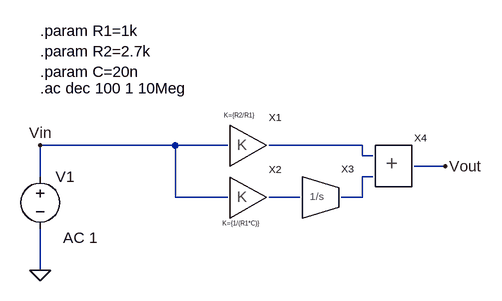
[diagram p0: schematic pid.asc]
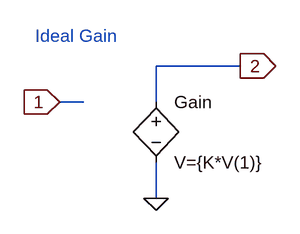
[diagram p1: sub-circuit gain.asc]
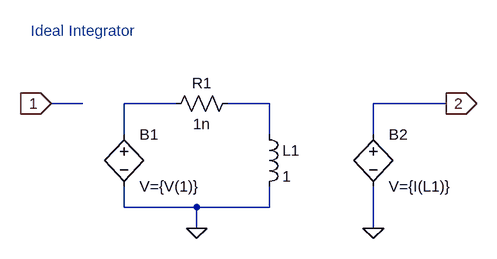
[diagram p2: sub-circuit integrator.asc]
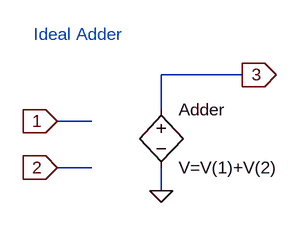
[diagram p3: sub-circuit adder.asc]
pid.asc, the LTspice schematic file:
Version 4
SHEET 1 880 680
WIRE 16 144 -192 144
WIRE 96 144 16 144
WIRE 304 144 160 144
WIRE 304 160 304 144
WIRE 320 160 304 160
WIRE 432 176 384 176
WIRE -192 192 -192 144
WIRE 320 192 304 192
WIRE 16 224 16 144
WIRE 96 224 16 224
WIRE 208 224 160 224
WIRE 304 224 304 192
WIRE 304 224 272 224
WIRE -192 336 -192 272
FLAG 432 176 Vout
FLAG -192 336 0
FLAG -192 144 Vin
SYMBOL gain 128 144 R0
WINDOW 39 -37 -46 Left 0
SYMATTR SpiceLine K={R2/R1}
SYMATTR InstName X1
SYMBOL gain 128 224 R0
WINDOW 39 -39 40 Left 0
SYMATTR SpiceLine K={1/(R1*C)}
SYMATTR InstName X2
SYMBOL integrator 240 224 R0
SYMATTR InstName X3
SYMBOL adder 352 176 R0
SYMATTR InstName X4
SYMBOL voltage -192 176 R0
WINDOW 123 35 110 Left 2
WINDOW 39 0 0 Left 0
WINDOW 3 35 82 Left 2
SYMATTR Value2 AC 1
SYMATTR Value ""
SYMATTR InstName V1
TEXT -192 -32 Left 2 !.param R1=1k\n.param R2=2.7k\n.param C=20n
TEXT -192 56 Left 2 !.ac dec 100 1 10Meg

gain.asc, the sub-circuit schematic file:
Version 4
SHEET 1 880 680
WIRE 224 64 112 64
WIRE 16 112 -16 112
WIRE 112 112 112 64
WIRE 112 240 112 192
FLAG -16 112 1
IOPIN -16 112 In
FLAG 224 64 2
IOPIN 224 64 Out
FLAG 112 240 0
SYMBOL bv 112 96 R0
SYMATTR InstName Gain
SYMATTR Value V={K*V(1)}
TEXT -48 24 Left 2 ;Ideal Gain

integrator.asc, the sub-circuit schematic file:
Version 4
SHEET 1 880 680
WIRE 32 96 -16 96
WIRE 176 96 96 96
WIRE 320 96 256 96
WIRE 592 96 480 96
WIRE 96 144 96 96
WIRE 320 144 320 96
WIRE 480 144 480 96
WIRE 96 256 96 224
WIRE 208 256 96 256
WIRE 320 256 320 224
WIRE 320 256 208 256
WIRE 208 288 208 256
WIRE 480 288 480 224
FLAG -16 96 1
IOPIN -16 96 In
FLAG 208 288 0
FLAG 480 288 0
FLAG 592 96 2
IOPIN 592 96 Out
SYMBOL bv 96 128 R0
SYMATTR InstName B1
SYMATTR Value V={V(1)}
SYMBOL bv 480 128 R0
SYMATTR InstName B2
SYMATTR Value V={I(L1)}
SYMBOL res 272 80 R90
WINDOW 0 0 56 VBottom 2
WINDOW 3 32 56 VTop 2
SYMATTR InstName R1
SYMATTR Value 1n
SYMBOL ind 304 128 R0
SYMATTR InstName L1
SYMATTR Value 1
TEXT -48 -16 Left 2 ;Ideal Integrator

adder.asc, the sub-circuit schematic file:
Version 4
SHEET 1 880 680
WIRE 288 32 176 32
WIRE 176 80 176 32
WIRE 80 96 32 96
WIRE 80 160 32 160
WIRE 176 192 176 160
FLAG 32 96 1
IOPIN 32 96 In
FLAG 32 160 2
IOPIN 32 160 In
FLAG 288 32 3
IOPIN 288 32 Out
FLAG 176 192 0
SYMBOL bv 176 64 R0
SYMATTR InstName Adder
SYMATTR Value V=V(1)+V(2)
TEXT 0 -24 Left 2 ;Ideal Adder

The netlist it stands for:
* pid.asc
XX1 Vin N001 gain params: K={R2/R1}
XX2 Vin N003 gain params: K={1/(R1*C)}
XX3 N003 N002 integrator
XX4 N001 N002 Vout adder
V1 Vin 0 AC 1

* block symbol definitions
.subckt gain 1 2
B§Gain 2 0 V={K*V(1)}
* Ideal Gain
.ends gain

.subckt integrator 1 2
B1 N001 0 V={V(1)}
B2 2 0 V={I(L1)}
R1 N002 N001 1n
L1 N002 0 1
* Ideal Integrator
.ends integrator

.subckt adder 1 2 3
B§Adder 3 0 V=V(1)+V(2)
* Ideal Adder
.ends adder

.param R1=1k
.param R2=2.7k
.param C=20n
.ac dec 100 1 10Meg
.backanno
.end